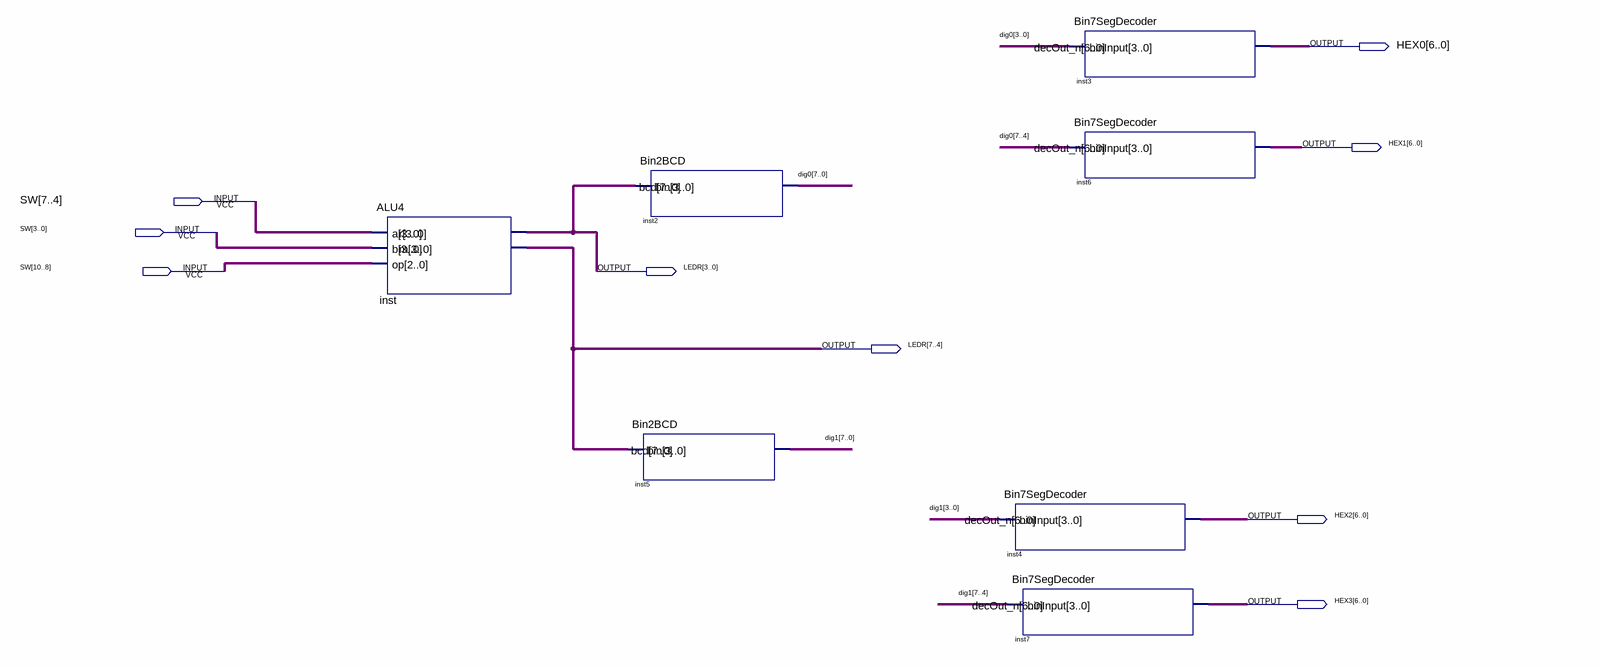
[diagram p0: schematic sheet]
// Quartus schematic ALUBinDemo.bdf as structural Verilog: 7 symbols, 9 pins
module ALUBinDemo (
  input  [10:0] SW,
  output [6:0] HEX0,
  output [6:0] HEX1,
  output [7:0] LEDR,
  output [6:0] HEX2,
  output [6:0] HEX3
);

  wire [7:0] dig0, dig1;

  ALU4 inst (.a(SW[7:4]), .b(SW[3:0]), .op(SW[10:8]), .r(LEDR[3:0]), .m(LEDR[7:4]));
  Bin2BCD inst5 (.bin(LEDR[7:4]), .bcd(dig1));
  Bin2BCD inst2 (.bin(LEDR[3:0]), .bcd(dig0));
  Bin7SegDecoder inst4 (.binInput(dig1[3:0]), .decOut_n(HEX2));
  Bin7SegDecoder inst7 (.binInput(dig1[7:4]), .decOut_n(HEX3));
  Bin7SegDecoder inst3 (.binInput(dig0[3:0]), .decOut_n(HEX0));
  Bin7SegDecoder inst6 (.binInput(dig0[7:4]), .decOut_n(HEX1));
endmodule
